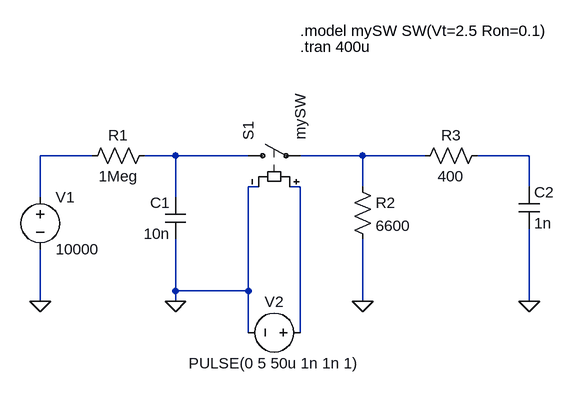
[diagram p0: schematic marx_generator_1stage.asc]
marx_generator_1stage.asc, the LTspice schematic file:
Version 4.1
SHEET 1 1372 680
WIRE 176 80 96 80
WIRE 304 80 256 80
WIRE 416 80 304 80
WIRE 592 80 496 80
WIRE 688 80 592 80
WIRE 848 80 768 80
WIRE 432 128 416 128
WIRE 496 128 480 128
WIRE 592 128 592 80
WIRE 848 128 848 80
WIRE 96 144 96 80
WIRE 304 144 304 80
WIRE 304 288 304 208
WIRE 416 288 416 128
WIRE 416 288 304 288
WIRE 96 304 96 224
WIRE 304 304 304 288
WIRE 592 304 592 208
WIRE 848 304 848 192
WIRE 416 352 416 288
WIRE 496 352 496 128
FLAG 848 304 0
FLAG 592 304 0
FLAG 304 304 0
FLAG 96 304 0
SYMBOL res 272 64 R90
WINDOW 0 0 56 VBottom 2
WINDOW 3 32 56 VTop 2
SYMATTR InstName R1
SYMATTR Value 1Meg
SYMBOL cap 320 208 R180
WINDOW 0 24 56 Left 2
WINDOW 3 24 8 Left 2
SYMATTR InstName C1
SYMATTR Value 10n
SYMBOL voltage 96 128 R0
WINDOW 123 0 0 Left 0
WINDOW 39 0 0 Left 0
SYMATTR InstName V1
SYMATTR Value 10000
SYMBOL sw 400 80 R270
SYMATTR InstName S1
SYMATTR Value mySW
SYMBOL voltage 512 352 R90
WINDOW 0 -32 56 VBottom 2
WINDOW 3 32 56 VTop 2
WINDOW 123 0 0 Left 0
WINDOW 39 0 0 Left 0
SYMATTR InstName V2
SYMATTR Value PULSE(0 5 50u 1n 1n 1)
SYMBOL res 576 112 R0
SYMATTR InstName R2
SYMATTR Value 6600
SYMBOL res 784 64 R90
WINDOW 0 0 56 VBottom 2
WINDOW 3 32 56 VTop 2
SYMATTR InstName R3
SYMATTR Value 400
SYMBOL cap 832 128 R0
SYMATTR InstName C2
SYMATTR Value 1n
TEXT 496 -112 Left 2 !.model mySW SW(Vt=2.5 Ron=0.1)
TEXT 496 -88 Left 2 !.tran 400u

The netlist it stands for:
* marx_generator_1stage.asc
R1 N002 N001 1Meg
C1 0 N002 10n
V1 N001 0 10000
S1 N002 N003 N005 0 mySW
V2 N005 0 PULSE(0 5 50u 1n 1n 1)
R2 N003 0 6600
R3 N004 N003 400
C2 N004 0 1n
.model mySW SW(Vt=2.5 Ron=0.1)
.tran 400u
.backanno
.end